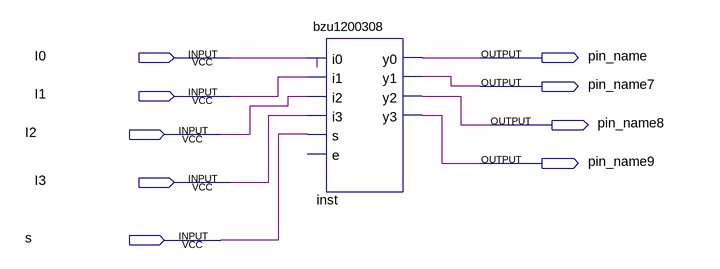
[diagram p0: schematic sheet]
// Quartus schematic system_oneend.bdf as structural Verilog: 1 symbols, 9 pins
module system_oneend (
  input  I0,
  input  I1,
  input  I2,
  input  I3,
  input  s,
  output pin_name,
  output pin_name7,
  output pin_name8,
  output pin_name9
);

  bzu1200308 inst (
    .i0(I0), .i1(I1), .i2(I2), .i3(I3), .s(s), .y0(pin_name), .y1(pin_name7), .y2(pin_name8), .y3(pin_name9));  // open: e
endmodule
